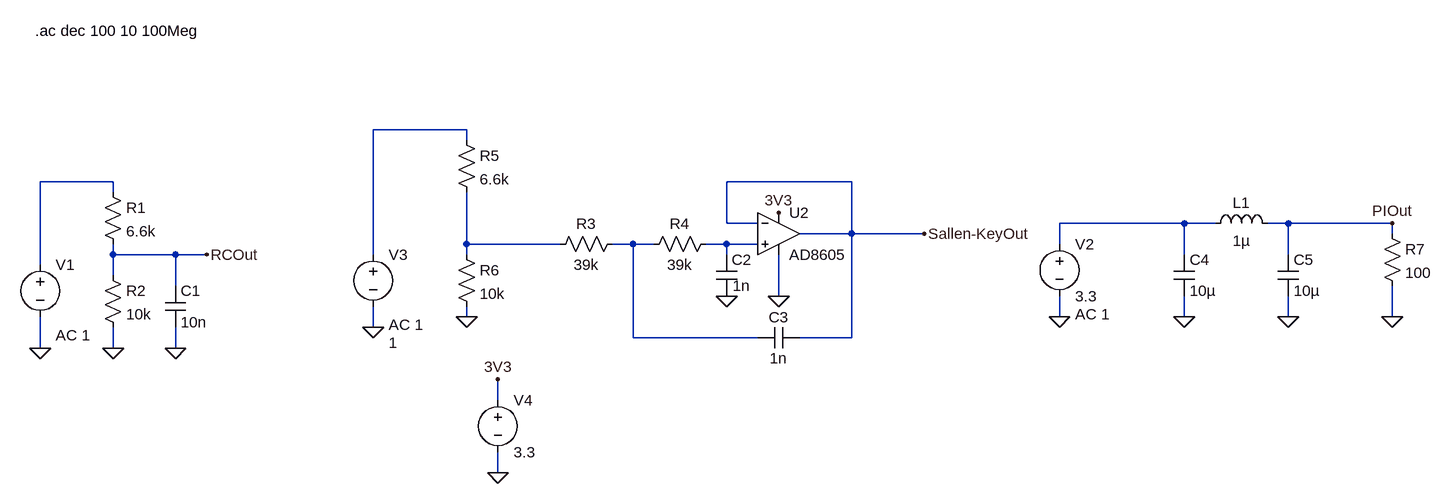
[diagram p0: schematic GMU.asc]
GMU.asc, the LTspice schematic file:
Version 4
SHEET 1 3040 788
WIRE 528 -48 384 -48
WIRE 528 -32 528 -48
WIRE -16 32 -128 32
WIRE 1120 32 928 32
WIRE -16 48 -16 32
WIRE 928 96 928 32
WIRE 976 96 928 96
WIRE 1632 96 1440 96
WIRE 1680 96 1632 96
WIRE 1792 96 1760 96
WIRE 1952 96 1792 96
WIRE 1120 112 1120 32
WIRE 1120 112 1040 112
WIRE 1232 112 1120 112
WIRE 1952 112 1952 96
WIRE 528 128 528 48
WIRE 672 128 528 128
WIRE 784 128 752 128
WIRE 816 128 784 128
WIRE 928 128 896 128
WIRE 976 128 928 128
WIRE 1440 128 1440 96
WIRE -16 144 -16 128
WIRE 80 144 -16 144
WIRE 128 144 80 144
WIRE 384 144 384 -48
WIRE 528 144 528 128
WIRE 928 144 928 128
WIRE 1632 144 1632 96
WIRE 1792 144 1792 96
WIRE -128 160 -128 32
WIRE -16 176 -16 144
WIRE 80 192 80 144
WIRE 1008 208 1008 144
WIRE 528 240 528 224
WIRE 1440 240 1440 208
WIRE 1632 240 1632 208
WIRE 1792 240 1792 208
WIRE 1952 240 1952 192
WIRE 384 256 384 224
WIRE 784 272 784 128
WIRE 976 272 784 272
WIRE 1120 272 1120 112
WIRE 1120 272 1040 272
WIRE -128 288 -128 240
WIRE -16 288 -16 256
WIRE 80 288 80 256
WIRE 576 368 576 336
WIRE 576 480 576 448
FLAG -16 288 0
FLAG 80 288 0
FLAG -128 288 0
FLAG 1008 208 0
FLAG 384 256 0
FLAG 1952 96 PIOut
FLAG 1008 80 3V3
FLAG 928 208 0
FLAG 528 240 0
FLAG 1632 240 0
FLAG 1792 240 0
FLAG 1952 240 0
FLAG 1440 240 0
FLAG 128 144 RCOut
FLAG 1232 112 Sallen-KeyOut
FLAG 576 480 0
FLAG 576 336 3V3
SYMBOL res -32 32 R0
SYMATTR InstName R1
SYMATTR Value 6.6k
SYMBOL res -32 160 R0
SYMATTR InstName R2
SYMATTR Value 10k
SYMBOL cap 64 192 R0
SYMATTR InstName C1
SYMATTR Value 10n
SYMBOL voltage -128 144 R0
WINDOW 123 24 124 Left 2
WINDOW 39 0 0 Left 0
SYMATTR Value2 AC 1
SYMATTR InstName V1
SYMATTR Value ""
SYMBOL voltage 1440 112 R0
WINDOW 123 24 124 Left 2
WINDOW 39 0 0 Left 0
SYMATTR Value2 AC 1
SYMATTR InstName V2
SYMATTR Value 3.3
SYMBOL voltage 384 128 R0
WINDOW 123 24 124 Left 2
WINDOW 39 0 0 Left 0
WINDOW 3 24 152 Left 2
SYMATTR Value2 AC 1
SYMATTR InstName V3
SYMATTR Value 1
SYMBOL res 768 112 R90
WINDOW 0 0 56 VBottom 2
WINDOW 3 32 56 VTop 2
SYMATTR InstName R3
SYMATTR Value 39k
SYMBOL res 912 112 R90
WINDOW 0 0 56 VBottom 2
WINDOW 3 32 56 VTop 2
SYMATTR InstName R4
SYMATTR Value 39k
SYMBOL cap 912 144 R0
WINDOW 3 25 48 Left 2
SYMATTR InstName C2
SYMATTR Value 1n
SYMBOL cap 1040 256 R90
WINDOW 0 0 32 VBottom 2
WINDOW 3 32 32 VTop 2
SYMATTR InstName C3
SYMATTR Value 1n
SYMBOL res 512 -48 R0
SYMATTR InstName R5
SYMATTR Value 6.6k
SYMBOL res 512 128 R0
SYMATTR InstName R6
SYMATTR Value 10k
SYMBOL OpAmps\\AD8605 1008 48 R0
SYMATTR InstName U2
SYMBOL cap 1616 144 R0
SYMATTR InstName C4
SYMATTR Value 10µ
SYMATTR SpiceLine Rser=1.6m Lser=0.7n Rpar=3Meg
SYMBOL ind 1664 112 R270
WINDOW 0 32 56 VTop 2
WINDOW 3 5 56 VBottom 2
SYMATTR InstName L1
SYMATTR Value 1µ
SYMATTR SpiceLine Rser=260m
SYMBOL res 1936 96 R0
SYMATTR InstName R7
SYMATTR Value 100
SYMBOL cap 1776 144 R0
SYMATTR InstName C5
SYMATTR Value 10µ
SYMATTR SpiceLine Rser=1.6m Lser=0.7n Rpar=3Meg
SYMBOL voltage 576 352 R0
WINDOW 123 0 0 Left 0
WINDOW 39 0 0 Left 0
SYMATTR InstName V4
SYMATTR Value 3.3
TEXT -136 -200 Left 2 !.ac dec 100 10 100Meg

The netlist it stands for:
* GMU.asc
R1 N002 RCOut 6.6k
R2 RCOut 0 10k
C1 RCOut 0 10n
V1 N002 0 AC 1
V2 N003 0 3.3 AC 1
V3 N001 0 1 AC 1
R3 N005 N004 39k
R4 N006 N005 39k
C2 N006 0 1n
C3 Sallen-KeyOut N005 1n
R5 N001 N004 6.6k
R6 N004 0 10k
XU2 N006 Sallen-KeyOut 3V3 0 Sallen-KeyOut AD8605  ; pins In+ In- V+ V- OUT
C4 N003 0 10µ Rser=1.6m Lser=0.7n Rpar=3Meg
L1 N003 PIOut 1µ Rser=260m
R7 PIOut 0 100
C5 PIOut 0 10µ Rser=1.6m Lser=0.7n Rpar=3Meg
V4 3V3 0 3.3
.ac dec 100 10 100Meg
.lib ADI.lib
.backanno
.end